# Altium schematic sheet Sheet1.SchDoc
size A4
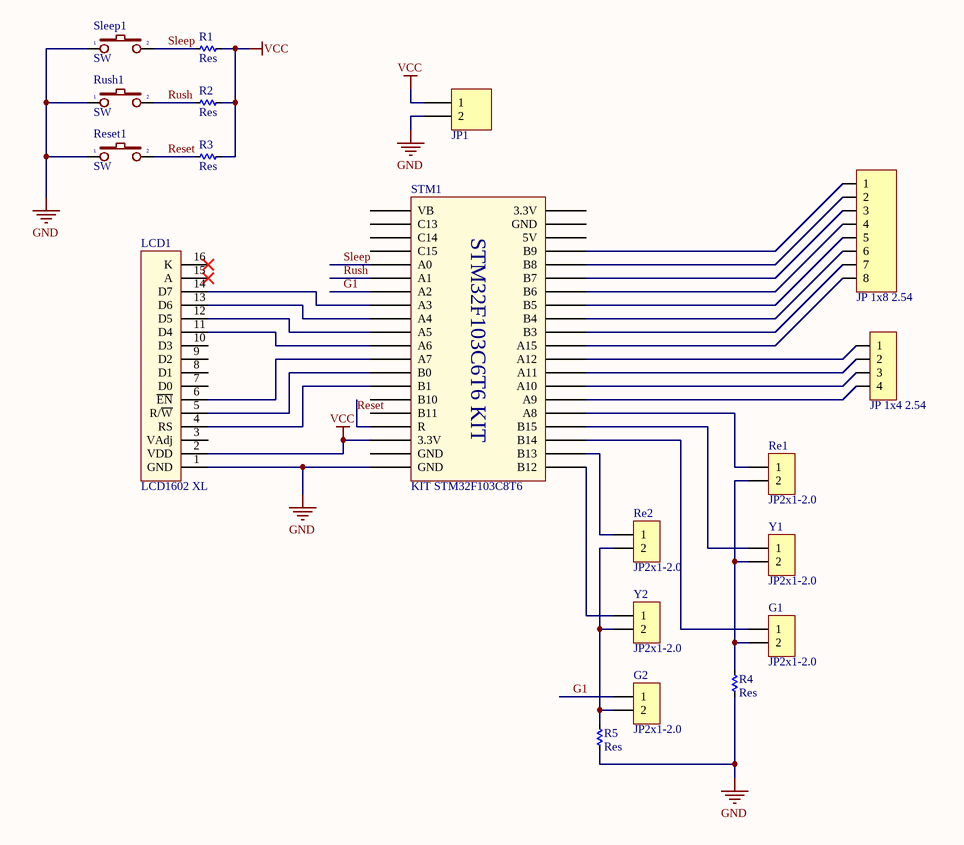
[diagram p0: Sheet1.SchDoc]

## Parts
Control7Seg  JP 1x4 2.54  [JP 1x4 DT]
G1  JP2x1-2.0  [J2-C1T]
G2  JP2x1-2.0  [J2-C1T]
JP1  Header 2_1  [HED2]  (value not drawn)
LCD1  LCD1602 XL  [LCD1602]
Led_pin  JP 1x8 2.54  [JP 1x8 DT]
R1  Res  [RES-1/2W]
R2  Res  [RES-1/2W]
R3  Res  [RES-1/2W]
R4  Res  [RES-1/2W]
R5  Res  [RES-1/2W]
Re1  JP2x1-2.0  [J2-C1T]
Re2  JP2x1-2.0  [J2-C1T]
Reset1  SW  [SW2]
Rush1  SW  [SW2]
Sleep1  SW  [SW2]
STM1  KIT STM32F103C8T6  [STM32F103 KIT]
Y1  JP2x1-2.0  [J2-C1T]
Y2  JP2x1-2.0  [J2-C1T]

## Nets
GND: JP1.2 LCD1.1(GND) R4.2 R5.2 Reset1.1 Rush1.1 Sleep1.1 STM1.40(GND)
VCC: JP1.1 LCD1.2(VDD) R1.1 R2.1 R3.1 STM1.38(3.3V)
G1: G2.1 STM1.27(A2)
Reset: R3.2 Reset1.2 STM1.37(R)
Rush: R2.2 Rush1.2 STM1.26(A1)
Sleep: R1.2 Sleep1.2 STM1.25(A0)
NetControl7Seg_1: Control7Seg.1 STM1.9(A12)
NetControl7Seg_2: Control7Seg.2 STM1.8(A11)
NetControl7Seg_3: Control7Seg.3 STM1.7(A10)
NetControl7Seg_4: Control7Seg.4 STM1.6(A9)
NetG1_1: G1.1 STM1.3(B14)
NetG1_2: G1.2 R4.1 Re1.2 Y1.2
NetG2_2: G2.2 R5.1 Re2.2 Y2.2
NetLCD1_4: LCD1.4(RS) STM1.34(B1)
NetLCD1_5: LCD1.5(R/~{W}) STM1.33(B0)
NetLCD1_6: LCD1.6(~{EN}) STM1.32(A7)
NetLCD1_11: LCD1.11(D4) STM1.31(A6)
NetLCD1_12: LCD1.12(D5) STM1.30(A5)
NetLCD1_13: LCD1.13(D6) STM1.29(A4)
NetLCD1_14: LCD1.14(D7) STM1.28(A3)
NetLed_pin_1: Led_pin.1 STM1.17(B9)
NetLed_pin_2: Led_pin.2 STM1.16(B8)
NetLed_pin_3: Led_pin.3 STM1.15(B7)
NetLed_pin_4: Led_pin.4 STM1.14(B6)
NetLed_pin_5: Led_pin.5 STM1.13(B5)
NetLed_pin_6: Led_pin.6 STM1.12(B4)
NetLed_pin_7: Led_pin.7 STM1.11(B3)
NetLed_pin_8: Led_pin.8 STM1.10(A15)
NetRe1_1: Re1.1 STM1.5(A8)
NetRe2_1: Re2.1 STM1.2(B13)
NetSTM1_1: STM1.1(B12) Y2.1
NetSTM1_4: STM1.4(B15) Y1.1

Not connected (* = marked no-connect by the designer): LCD1 3(VAdj) 7(D0) 8(D1) 9(D2) 10(D3) 15(A)* 16(K)*; STM1 18(5V) 19(GND) 20(3.3V) 21(VB) 22(C13) 23(C14) 24(C15) 35(B10) 36(B11) 39(GND)

## Notes on the sheet
- (in symbol STM32f103 Bluepill) STM32F103C6T6 KIT

## Library data of the parts
Control7Seg = JP 1x4 2.54 Duc Thang: Cắm; Ten_Linh_Kien: Jump Đơn Đực 2.54MM 1x40P Thẳng 11MM; Don_Vi: Con; Ma_Hang: MH000903; Ghi_Chu: *; Kieu_Chan: *; Chung_Loai: Cắm
G1 G2 Re1 Re2 Y1 Y2 = JP2x1-2.0: WR-PHD 2.00 mm Socket Header; Manufacturer: W¨¹rth Elektronik eiSos GmbH; partNo: 62000211821; ComponentLink1 Description: Manufacturer; ComponentLink2 Description: Datasheet; NoPins: 02; Created Date: 2 April 2013; ComponentLink1URL: http://www.we-online.com; ComponentLink2URL: http://katalog.we-online.de/em/datasheet/6200xx11821.pdf; Created by: Karrer Zheng
JP1 = Header 2_1: Header, 2-Pin; Manufacturer: Generic Components; Class: Connector; Value: Header 2
LCD1 = LCD1602 XL: LCD 1602 Xanh Lá; Ten: Màn hình LCD 1602 Xanh Lá; Ma_Hang: 67HZ; NCC: NSHOP; CHIP: HD44780
Led_pin = JP 1x8 2.54 Duc Thang: Cắm; Ten_Linh_Kien: Jump Đơn Đực 2.54MM 1x40P Thẳng 11MM; Don_Vi: Con; Ma_Hang: MH000903; Ghi_Chu: *; Kieu_Chan: *; Chung_Loai: Cắm
R1-R5 = Res: Manufacturer: Generic Components; Class: Passive; SubClass: R; Published: 08/06/2000; Publisher: Altium Hobart Technology Centre
Reset1 Rush1 Sleep1 = SW2: Switch button 2 pin; Value: SW chip 2 pin
STM1 = STM32f103 Bluepill: KIT STM32F103C8T6 Bluepill